# Altium schematic sheet LED.SchDoc
size A4; SheetNumber: 7; SheetTotal: 15
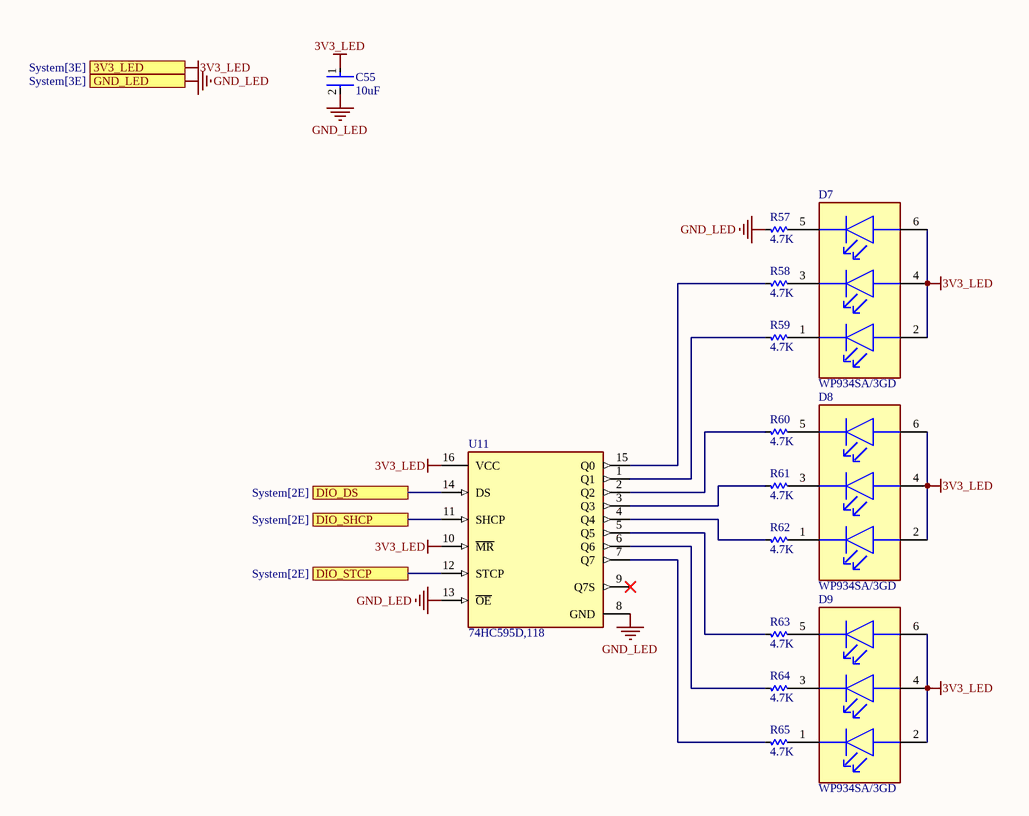
[diagram p0: LED.SchDoc]

## Parts
C55  10uF  [FP-CC0603-DA-IPC_B]
D7  WP934SA/3GD  [FP-WP934SA-3GD-MFG]
D8  WP934SA/3GD  [FP-WP934SA-3GD-MFG]
D9  WP934SA/3GD  [FP-WP934SA-3GD-MFG]
R57  4.7K  [RES-SMD-0603]
R58  4.7K  [RES-SMD-0603]
R59  4.7K  [RES-SMD-0603]
R60  4.7K  [RES-SMD-0603]
R61  4.7K  [RES-SMD-0603]
R62  4.7K  [RES-SMD-0603]
R63  4.7K  [RES-SMD-0603]
R64  4.7K  [RES-SMD-0603]
R65  4.7K  [RES-SMD-0603]
U11  74HC595D,118  [FP-SOT109-1-IPC_A]

## Ports
3V3_LED (see System[3E]), DIO_DS (see System[2E]), DIO_SHCP (see System[2E]), DIO_STCP (see System[2E]), GND_LED (see System[3E])

## Nets
3V3_LED: C55.1 D7.2(1_ANODE) D7.4(2_ANODE) D7.6(3_ANODE) D8.2(1_ANODE) D8.4(2_ANODE) D8.6(3_ANODE) D9.2(1_ANODE) D9.4(2_ANODE) D9.6(3_ANODE) U11.10(~{MR}) U11.16(VCC) ; port 3V3_LED
GND_LED: C55.2 R57.2 U11.8(GND) U11.13(~{OE}) ; port GND_LED
DIO_DS: U11.14(DS) ; port DIO_DS
DIO_SHCP: U11.11(SHCP) ; port DIO_SHCP
DIO_STCP: U11.12(STCP) ; port DIO_STCP
NetD7_1: D7.1(1_CATHODE) R59.1
NetD7_3: D7.3(2_CATHODE) R58.1
NetD7_5: D7.5(3_CATHODE) R57.1
NetD8_1: D8.1(1_CATHODE) R62.1
NetD8_3: D8.3(2_CATHODE) R61.1
NetD8_5: D8.5(3_CATHODE) R60.1
NetD9_1: D9.1(1_CATHODE) R65.1
NetD9_3: D9.3(2_CATHODE) R64.1
NetD9_5: D9.5(3_CATHODE) R63.1
NetR58_2: R58.2 U11.15(Q0)
NetR59_2: R59.2 U11.1(Q1)
NetR60_2: R60.2 U11.2(Q2)
NetR61_2: R61.2 U11.3(Q3)
NetR62_2: R62.2 U11.4(Q4)
NetR63_2: R63.2 U11.5(Q5)
NetR64_2: R64.2 U11.6(Q6)
NetR65_2: R65.2 U11.7(Q7)

Not connected (* = marked no-connect by the designer): U11 9(Q7S)*

## Library data of the parts
C55 = CMP-2000-05002-2: CAP CER X7R 0603; Manufacturer Part Number: CC0603KRX7R7BB104; Manufacturer: YAGEO; Voltage Rating: 16 V; Tolerance: 0.1; Value: 100 nF; Temperature Coefficient: 15%; Material: Ceramic; Package: CC0603-DA; ComponentLink2Description: Datasheet; Octopart: https://octopart.com/cc0603krx7r7bb104-yageo-192941; Temperature Range High: +125°C; Digikey Description: CAP CER 0.1UF 16V X7R 0603; Voltage: 16 V; Device Class L2: Capacitors; Height: 0.9mm; Temperature: -55°C to +125°C; Device Class L1: Passive Components; Device Class L3: Ceramic Capacitors; ComponentLink2URL: http://www.yageo.com/documents/recent/UPY-GPHC_X7R_6.3V-to-50V_18.pdf; Footprint Url: http://www.yageo.com/exep/pages/download/literatures/UPY-C_GEN_24.pdf; RoHS: TRUE; Temperature Range Low: -55°C; Temperature Characteristic: X7R; Lead Free: Yes; Capacitance: 100 nF; Category: Cap; Mouser Description: Multilayer Ceramic Capacitor, CC Series, 0.1 - F, - 10%, X7R, 16 V, 0603 [1608 Metric]; Automotive: No
D7-D9 = CMP-44529-000026-1: LED IND 3MM TRI-LVL RA GRN DIFF; Illumination Color: Green; Forward Current: 20mA; Viewing Angle: 40°; Luminous Intensity: 20mcd; Voltage Rating: 2.2V; Wavelength: 568nm; Lens Style: Diffused; Mount: Through Hole; Current: 20mA; Forward Voltage: 2.2V; Color: Green; Package Quantity: 125; Lens Color: Green; Packaging: Rail/Tube; Lead Free: Lead Free
R57-R65 = Res-SMD: Res 0603 5%; Manufacturer: Generic Components; Class: Passive; Published: 08/06/2000; Publisher: Altium Hobart Technology Centre
U11 = CMP-14351-000006-1: IC SHIFT REGISTER 8BIT 16SOIC; RoHS Compliant: Yes